# EAGLE design RW_CAN (EAGLE 8.4.3)
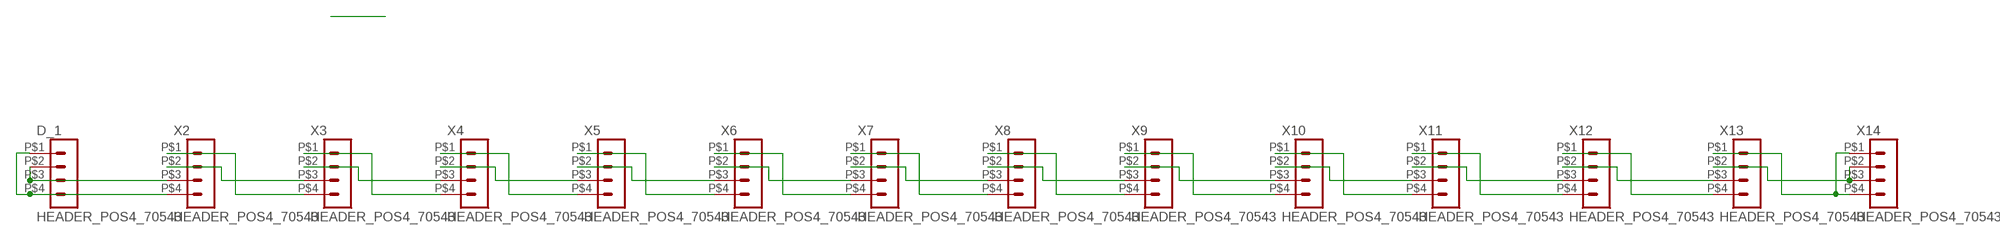
[diagram p0: schematic, sheet 1]

## Parts
D_1  HEADER_POS4_70543  [70543-POS4]
X2  HEADER_POS4_70543  [70543-POS4]
X3  HEADER_POS4_70543  [70543-POS4]
X4  HEADER_POS4_70543  [70543-POS4]
X5  HEADER_POS4_70543  [70543-POS4]
X6  HEADER_POS4_70543  [70543-POS4]
X7  HEADER_POS4_70543  [70543-POS4]
X8  HEADER_POS4_70543  [70543-POS4]
X9  HEADER_POS4_70543  [70543-POS4]
X10  HEADER_POS4_70543  [70543-POS4]
X11  HEADER_POS4_70543  [70543-POS4]
X12  HEADER_POS4_70543  [70543-POS4]
X13  HEADER_POS4_70543  [70543-POS4]
X14  HEADER_POS4_70543  [70543-POS4]

## Nets
N$5: X2.P$2 X3.P$3
N$7: D_1.P$1 D_1.P$4 X2.P$4
N$8: D_1.P$2 D_1.P$3 X2.P$3
N$9: X2.P$1 X3.P$4
N$10: X3.P$2 X4.P$3
N$11: X3.P$1 X4.P$4
N$12: X4.P$2 X5.P$3
N$13: X4.P$1 X5.P$4
N$14: X5.P$2 X6.P$3
N$15: X5.P$1 X6.P$4
N$16: X6.P$2 X7.P$3
N$17: X6.P$1 X7.P$4
N$18: X7.P$2 X8.P$3
N$19: X7.P$1 X8.P$4
N$20: X8.P$2 X9.P$3
N$21: X8.P$1 X9.P$4
N$22: X9.P$2 X10.P$3
N$23: X9.P$1 X10.P$4
N$24: X10.P$2 X11.P$3
N$25: X10.P$1 X11.P$4
N$26: X11.P$2 X12.P$3
N$27: X11.P$1 X12.P$4
N$28: X12.P$2 X13.P$3
N$29: X12.P$1 X13.P$4
N$30: X13.P$2 X14.P$2 X14.P$3
N$31: X13.P$1 X14.P$1 X14.P$4

## Library data of the parts
D_1 X2-X14 = con-molex-c-grid-sl:HEADER_POS4_?: Molex -C-Grid® / SL Series connector Wire-to-Board 2.54 mm (0.100") pitch header, 4 positions.

## Board
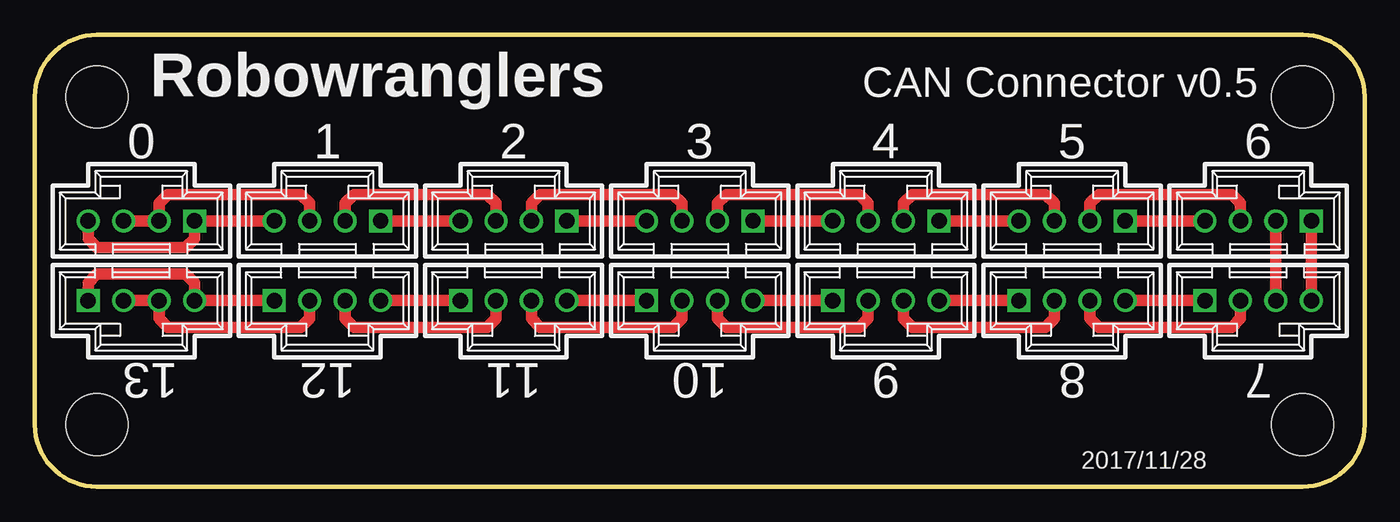
[diagram p1: board, top side]
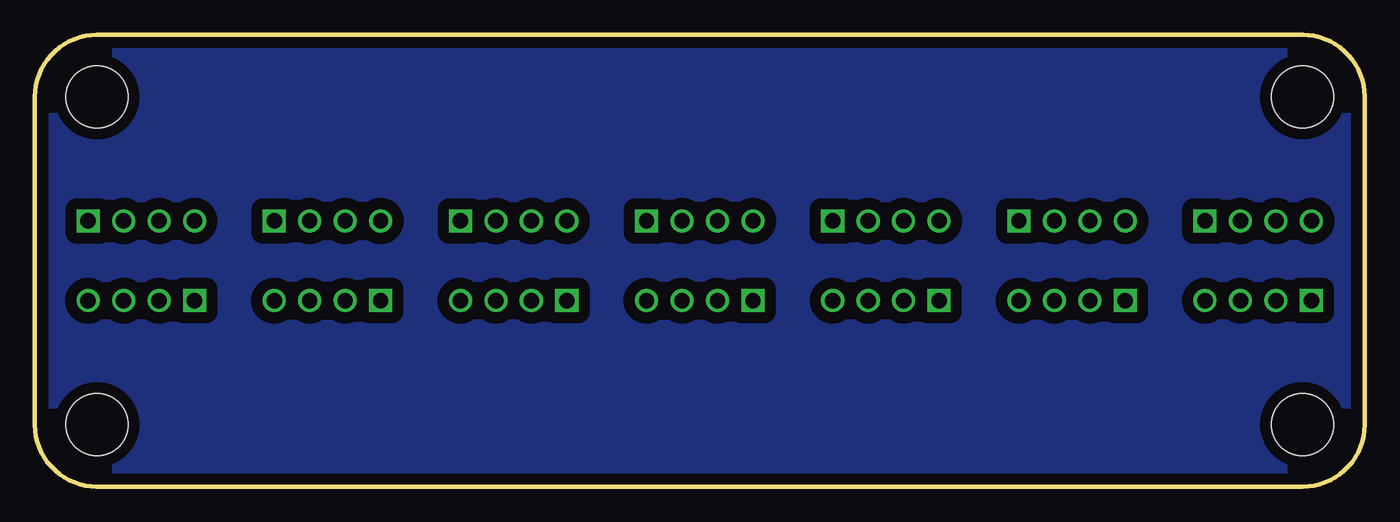
[diagram p2: board, bottom side, seen from below]

Size 95.25 x 32.38 mm. Coordinates in mm from the lower left corner, seen from the top.
Outline: 4.45,32.38 90.81,32.38 arc-90 95.25,27.94 95.25,4.45 arc-90 90.81,0 4.45,0 arc-90 0,4.45 0,27.94 arc-90 4.45,32.38
Copper layers (1*16): Top 0.035mm / dielectric 1.5mm / Bottom 0.035mm
Design rules "SeeedStudio_2layer_DRU_no_angle_20140221": minimum track width 6mil, minimum drill 12mil, track to track 6mil, track to pad 6mil, pad to pad 6mil, via to via 6mil, smd to smd 0mil, copper to edge 10mil, drill to drill 10mil, minimum pad ring 10mil, minimum via ring 6mil, stop-mask expansion 2mil, vias tented up to drill 100mil, thermal gap 10mil
Holes 4.45 mm at 4.45,4.45 90.81,4.45 90.81,27.94 4.45,27.94

### Footprints (pad centres in the part's own frame; a part is rotated, then mirrored left to right if it is on the bottom)
70543-POS4 = drill 1.1 square: P$1 3.81,0 | drill 1.1: P$2 1.27,0; P$3 -1.27,0; P$4 -3.81,0

### Placement (x,y rotation side)
D_1  7.62,19.05 0 top
X2  20.95,19.05 0 top
X3  34.29,19.05 0 top
X4  47.62,19.05 0 top
X5  60.96,19.05 0 top
X6  74.3,19.05 0 top
X7  87.63,19.05 0 top
X8  87.63,13.34 180 top
X9  74.3,13.34 180 top
X10  60.96,13.34 180 top
X11  47.62,13.34 180 top
X12  34.29,13.34 180 top
X13  20.95,13.34 180 top
X14  7.62,13.34 180 top

### Tracks (layer width: path | path; a pad name or v marks a point on that pad's centre or on a via)
N$5
  Top 0.813: X3.P$3 33.02,20.32 32.38,20.95 22.86,20.95 22.23,20.32 X2.P$2
N$7
  Top 0.813: X2.P$4 D_1.P$1 11.43,17.78 10.79,17.14 4.45,17.14 3.81,17.78 D_1.P$4
N$8
  Top 0.813: D_1.P$2 8.89,19.68 | D_1.P$2 D_1.P$3 | X2.P$3 19.68,20.32 19.05,20.95 9.53,20.95 8.89,20.32 D_1.P$2
N$9
  Top 0.813: X2.P$1 X3.P$4
N$10
  Top 0.813: X4.P$3 46.35,20.32 45.72,20.95 36.2,20.95 35.56,20.32 X3.P$2
N$11
  Top 0.813: X4.P$4 X3.P$1
N$12
  Top 0.813: X5.P$3 59.69,20.32 59.05,20.95 49.53,20.95 48.9,20.32 X4.P$2
N$13
  Top 0.813: X4.P$1 X5.P$4
N$14
  Top 0.813: X6.P$3 73.03,20.32 72.39,20.95 62.87,20.95 62.23,20.32 X5.P$2
N$15
  Top 0.813: X5.P$1 X6.P$4
N$16
  Top 0.813: X6.P$2 75.56,20.32 76.2,20.95 85.72,20.95 86.36,20.32 X7.P$3
N$17
  Top 0.813: X6.P$1 X7.P$4
N$18
  Top 0.813: X7.P$2 X8.P$3
N$19
  Top 0.813: X7.P$1 X8.P$4
N$20
  Top 0.813: X8.P$2 86.36,12.06 85.72,11.43 76.2,11.43 75.56,12.06 X9.P$3
N$21
  Top 0.813: X8.P$1 X9.P$4
N$22
  Top 0.813: X10.P$3 62.23,12.06 62.87,11.43 72.39,11.43 73.03,12.06 X9.P$2
N$23
  Top 0.813: X9.P$1 X10.P$4
N$24
  Top 0.813: X11.P$3 48.9,12.06 49.53,11.43 59.05,11.43 59.69,12.06 X10.P$2
N$25
  Top 0.813: X10.P$1 X11.P$4
N$26
  Top 0.813: X12.P$3 35.56,12.06 36.2,11.43 45.72,11.43 46.35,12.06 X11.P$2
N$27
  Top 0.813: X12.P$4 X11.P$1
N$28
  Top 0.813: X13.P$3 22.23,12.06 22.86,11.43 32.38,11.43 33.02,12.06 X12.P$2
N$29
  Top 0.813: X12.P$1 X13.P$4
N$30
  Top 0.813: X14.P$2 X14.P$3 8.89,12.06 9.53,11.43 19.05,11.43 19.68,12.06 X13.P$2
N$31
  Top 0.813: X13.P$1 X14.P$4 11.43,14.61 10.79,15.24 4.45,15.24 3.81,14.61 X14.P$1
N$33
  pour Bottom (isolate 0.813, no thermals): 0,20.95 0,4.45 arc90 4.45,0 90.81,0 arc90 95.25,4.45 95.25,28.57 arc90 91.44,32.38 4.45,32.38 arc90 0,27.94

### Text on the board
tNames: Robowranglers | CAN Connector v0.5 | 0 | 1 | 2 | 3 | 4 | 5 | 6 | 13 | 12 | 11 | 10 | 9 | 8 | 7 | 2017/11/28